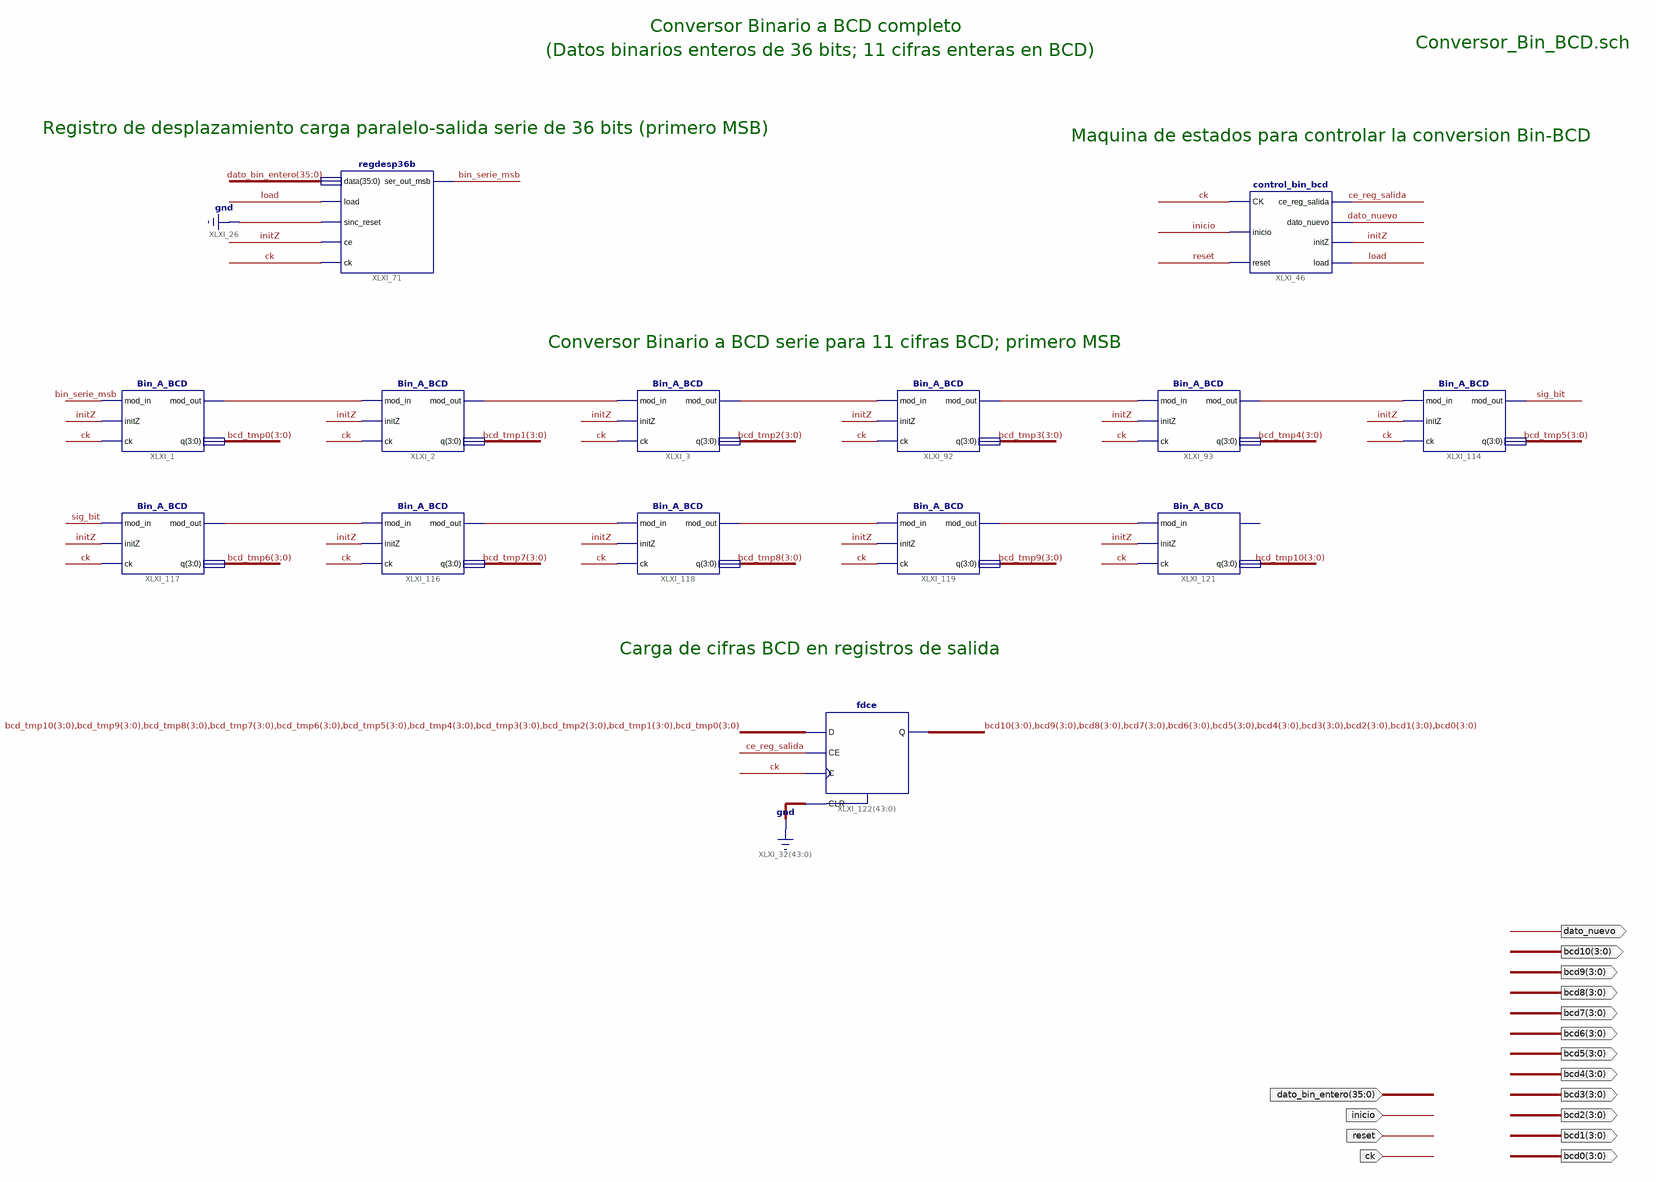
[diagram p0: schematic sheet 1]
// Xilinx ISE schematic Conversor_Bin_BCD.sch (spartan6) as structural Verilog: 14 symbols, 16 ports
module Conversor_Bin_BCD (
  input  ck,
  input  inicio,
  input  reset,
  input  [35:0] dato_bin_entero,
  output dato_nuevo,
  output [3:0] bcd0,
  output [3:0] bcd1,
  output [3:0] bcd2,
  output [3:0] bcd3,
  output [3:0] bcd4,
  output [3:0] bcd5,
  output [3:0] bcd6,
  output [3:0] bcd7,
  output [3:0] bcd8,
  output [3:0] bcd9,
  output [3:0] bcd10
);

  wire bin_serie_msb, ce_reg_salida, initZ, load, sig_bit, XLXN_8, XLXN_9, XLXN_562, XLXN_563, XLXN_564,
       XLXN_568, XLXN_569, XLXN_588, XLXN_589;
  wire [3:0] bcd_tmp0, bcd_tmp1, bcd_tmp2, bcd_tmp3, bcd_tmp4, bcd_tmp5, bcd_tmp6, bcd_tmp7, bcd_tmp8,
       bcd_tmp9, bcd_tmp10;

  control_bin_bcd XLXI_46 (
    .CK(ck), .inicio(inicio), .reset(reset), .ce_reg_salida(ce_reg_salida), .dato_nuevo(dato_nuevo),
    .initZ(initZ), .load(load));
  Bin_A_BCD XLXI_2 (.mod_out(XLXN_8), .q(bcd_tmp1), .mod_in(XLXN_9), .initZ(initZ), .ck(ck));
  Bin_A_BCD XLXI_1 (.mod_out(XLXN_9), .q(bcd_tmp0), .mod_in(bin_serie_msb), .initZ(initZ), .ck(ck));
  Bin_A_BCD XLXI_3 (.mod_out(XLXN_564), .q(bcd_tmp2), .mod_in(XLXN_8), .initZ(initZ), .ck(ck));
  Bin_A_BCD XLXI_92 (.mod_out(XLXN_563), .q(bcd_tmp3), .mod_in(XLXN_564), .initZ(initZ), .ck(ck));
  Bin_A_BCD XLXI_114 (.mod_out(sig_bit), .q(bcd_tmp5), .mod_in(XLXN_562), .initZ(initZ), .ck(ck));
  Bin_A_BCD XLXI_93 (.mod_out(XLXN_562), .q(bcd_tmp4), .mod_in(XLXN_563), .initZ(initZ), .ck(ck));
  Bin_A_BCD XLXI_116 (.mod_out(XLXN_568), .q(bcd_tmp7), .mod_in(XLXN_569), .initZ(initZ), .ck(ck));
  Bin_A_BCD XLXI_117 (.mod_out(XLXN_569), .q(bcd_tmp6), .mod_in(sig_bit), .initZ(initZ), .ck(ck));
  Bin_A_BCD XLXI_118 (.mod_out(XLXN_589), .q(bcd_tmp8), .mod_in(XLXN_568), .initZ(initZ), .ck(ck));
  Bin_A_BCD XLXI_119 (.mod_out(XLXN_588), .q(bcd_tmp9), .mod_in(XLXN_589), .initZ(initZ), .ck(ck));
  Bin_A_BCD XLXI_121 (.q(bcd_tmp10), .mod_in(XLXN_588), .initZ(initZ), .ck(ck));  // open: mod_out
  fdce XLXI_122[43:0] (
    .C(ck), .CE(ce_reg_salida), .CLR({44{1'b0}}),
    .D({bcd_tmp10, bcd_tmp9, bcd_tmp8, bcd_tmp7, bcd_tmp6, bcd_tmp5, bcd_tmp4, bcd_tmp3, bcd_tmp2, bcd_tmp1, bcd_tmp0}),
    .Q({bcd10, bcd9, bcd8, bcd7, bcd6, bcd5, bcd4, bcd3, bcd2, bcd1, bcd0}));
  regdesp36b XLXI_71 (
    .sinc_reset(1'b0), .ck(ck), .ce(initZ), .load(load), .data(dato_bin_entero), .ser_out_msb(bin_serie_msb));

  // Notes on the sheet:
  //   Conversor Binario a BCD completo
  //   Conversor_Bin_BCD.sch
  //   (Datos binarios enteros de 36 bits; 11 cifras enteras en BCD)
  //   Registro de desplazamiento carga paralelo-salida serie de 36 bits (primero MSB)
  //   Maquina de estados para controlar la conversion Bin-BCD
  //   Conversor Binario a BCD serie para 11 cifras BCD; primero MSB
  //   Carga de cifras BCD en registros de salida
endmodule
